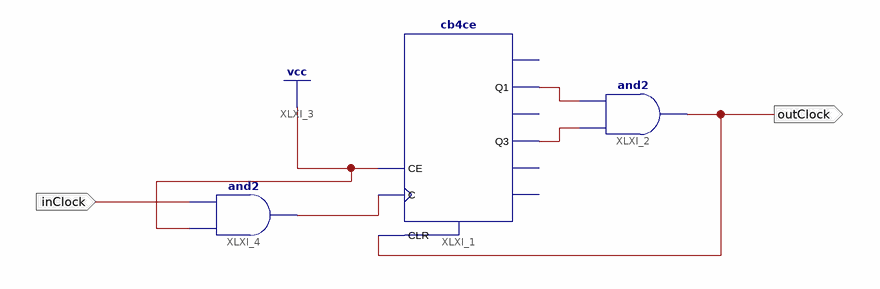
[diagram p0: schematic sheet 1]
// Xilinx ISE schematic div10.sch (spartan6) as structural Verilog: 3 symbols, 2 ports
module div10 (
  input  inClock,
  output outClock
);

  wire XLXN_1, XLXN_2, XLXN_7;

  cb4ce XLXI_1 (.C(XLXN_7), .CE(1'b1), .CLR(outClock), .Q1(XLXN_1), .Q3(XLXN_2));  // open: CEO, Q0, Q2, TC
  and XLXI_2 (outClock, XLXN_2, XLXN_1);
  and XLXI_4 (XLXN_7, 1'b1, inClock);
endmodule
